# Altium schematic sheet I2C_Protection.SchDoc
size A; SheetNumber: 4; SheetTotal: 5
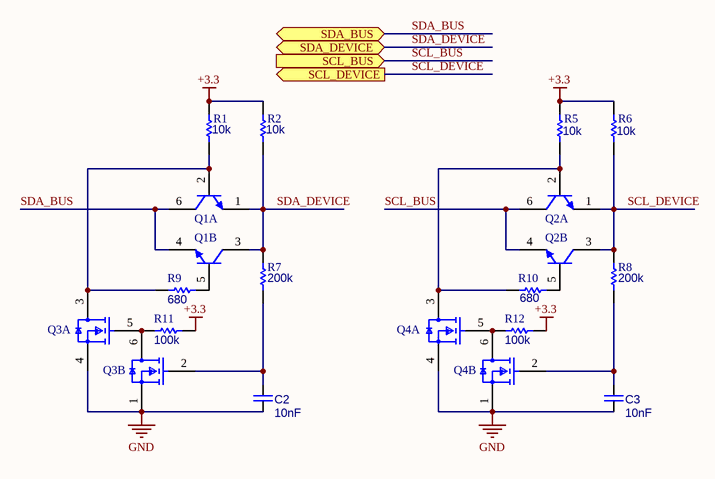
[diagram p0: I2C_Protection.SchDoc]

## Parts
C2  value 10nF  [C0805A]  (hidden comment: Capacitor)
C3  value 10nF  [C0805A]  (hidden comment: Capacitor)
Q1  MBT2222ADW1T1  [ONSC-SOT-363-6-419B-02_V]  (value not drawn)  (parts A,B of 2)
Q2  MBT2222ADW1T1  [ONSC-SOT-363-6-419B-02_V]  (value not drawn)  (parts A,B of 2)
Q3  BSS138DW-7-F  [FP-SOT363-IPC_C]  (value not drawn)  (parts A,B of 2)
Q4  BSS138DW-7-F  [FP-SOT363-IPC_C]  (value not drawn)  (parts A,B of 2)
R1  value 10k  [R0603A]  (hidden comment: Resistor)
R2  value 10k  [R0603A]  (hidden comment: Resistor)
R5  value 10k  [R0603A]  (hidden comment: Resistor)
R6  value 10k  [R0603A]  (hidden comment: Resistor)
R7  value 200k  [R0603A]  (hidden comment: RMCF0603FT200K)
R8  value 200k  [R0603A]  (hidden comment: RMCF0603FT200K)
R9  value 680  [R0603A]  (hidden comment: RMCF0603FT680R)
R10  value 680  [R0603A]  (hidden comment: RMCF0603FT680R)
R11  value 100k  [R0603A]  (hidden comment: RMCF0603JT100K)
R12  value 100k  [R0603A]  (hidden comment: RMCF0603JT100K)

## Ports
SCL_BUS (in), SCL_DEVICE (out), SDA_BUS (bidir), SDA_DEVICE (bidir)

## Nets
+3.3: R1.2 R2.2 R5.2 R6.2 R11.1 R12.1
GND: C2.1 C3.1 Q3.1(S2) Q3.4(S1) Q4.1(S2) Q4.4(S1)
SCL_BUS: Q2.4(E) Q2.6(C) ; port SCL_BUS
SCL_DEVICE: Q2.1(E) Q2.3(C) R6.1 R8.2 ; port SCL_DEVICE
SDA_BUS: Q1.4(E) Q1.6(C) ; port SDA_BUS
SDA_DEVICE: Q1.1(E) Q1.3(C) R2.1 R7.2 ; port SDA_DEVICE
NetC2_2: C2.2 Q3.2(G2) R7.1
NetC3_2: C3.2 Q4.2(G2) R8.1
NetQ1_2: Q1.2(B) Q3.3(D1) R1.1 R9.1
NetQ1_5: Q1.5(B) R9.2
NetQ2_2: Q2.2(B) Q4.3(D1) R5.1 R10.1
NetQ2_5: Q2.5(B) R10.2
NetQ3_5: Q3.5(G1) Q3.6(D2) R11.2
NetQ4_5: Q4.5(G1) Q4.6(D2) R12.2

## Library data of the parts
C2 C3 = CMP-001-00000-8: Non-polarized capacitor
Q1 Q2 = CMP-004-0018-1: Small Signal Bipolar Transistor
Q3 Q4 = CMP-004-0019-1: Dual N-Channel 50 V 3.5 Ohm Surface Mount Enhancement MosFet - SOT-363
R1 R2 R5 R6 = CMP-009-00002-11
R7-R12 = CMP-009-00002-11: Resistor